# EAGLE design EXT_LED_RGB_NPN (EAGLE 6.5.0)
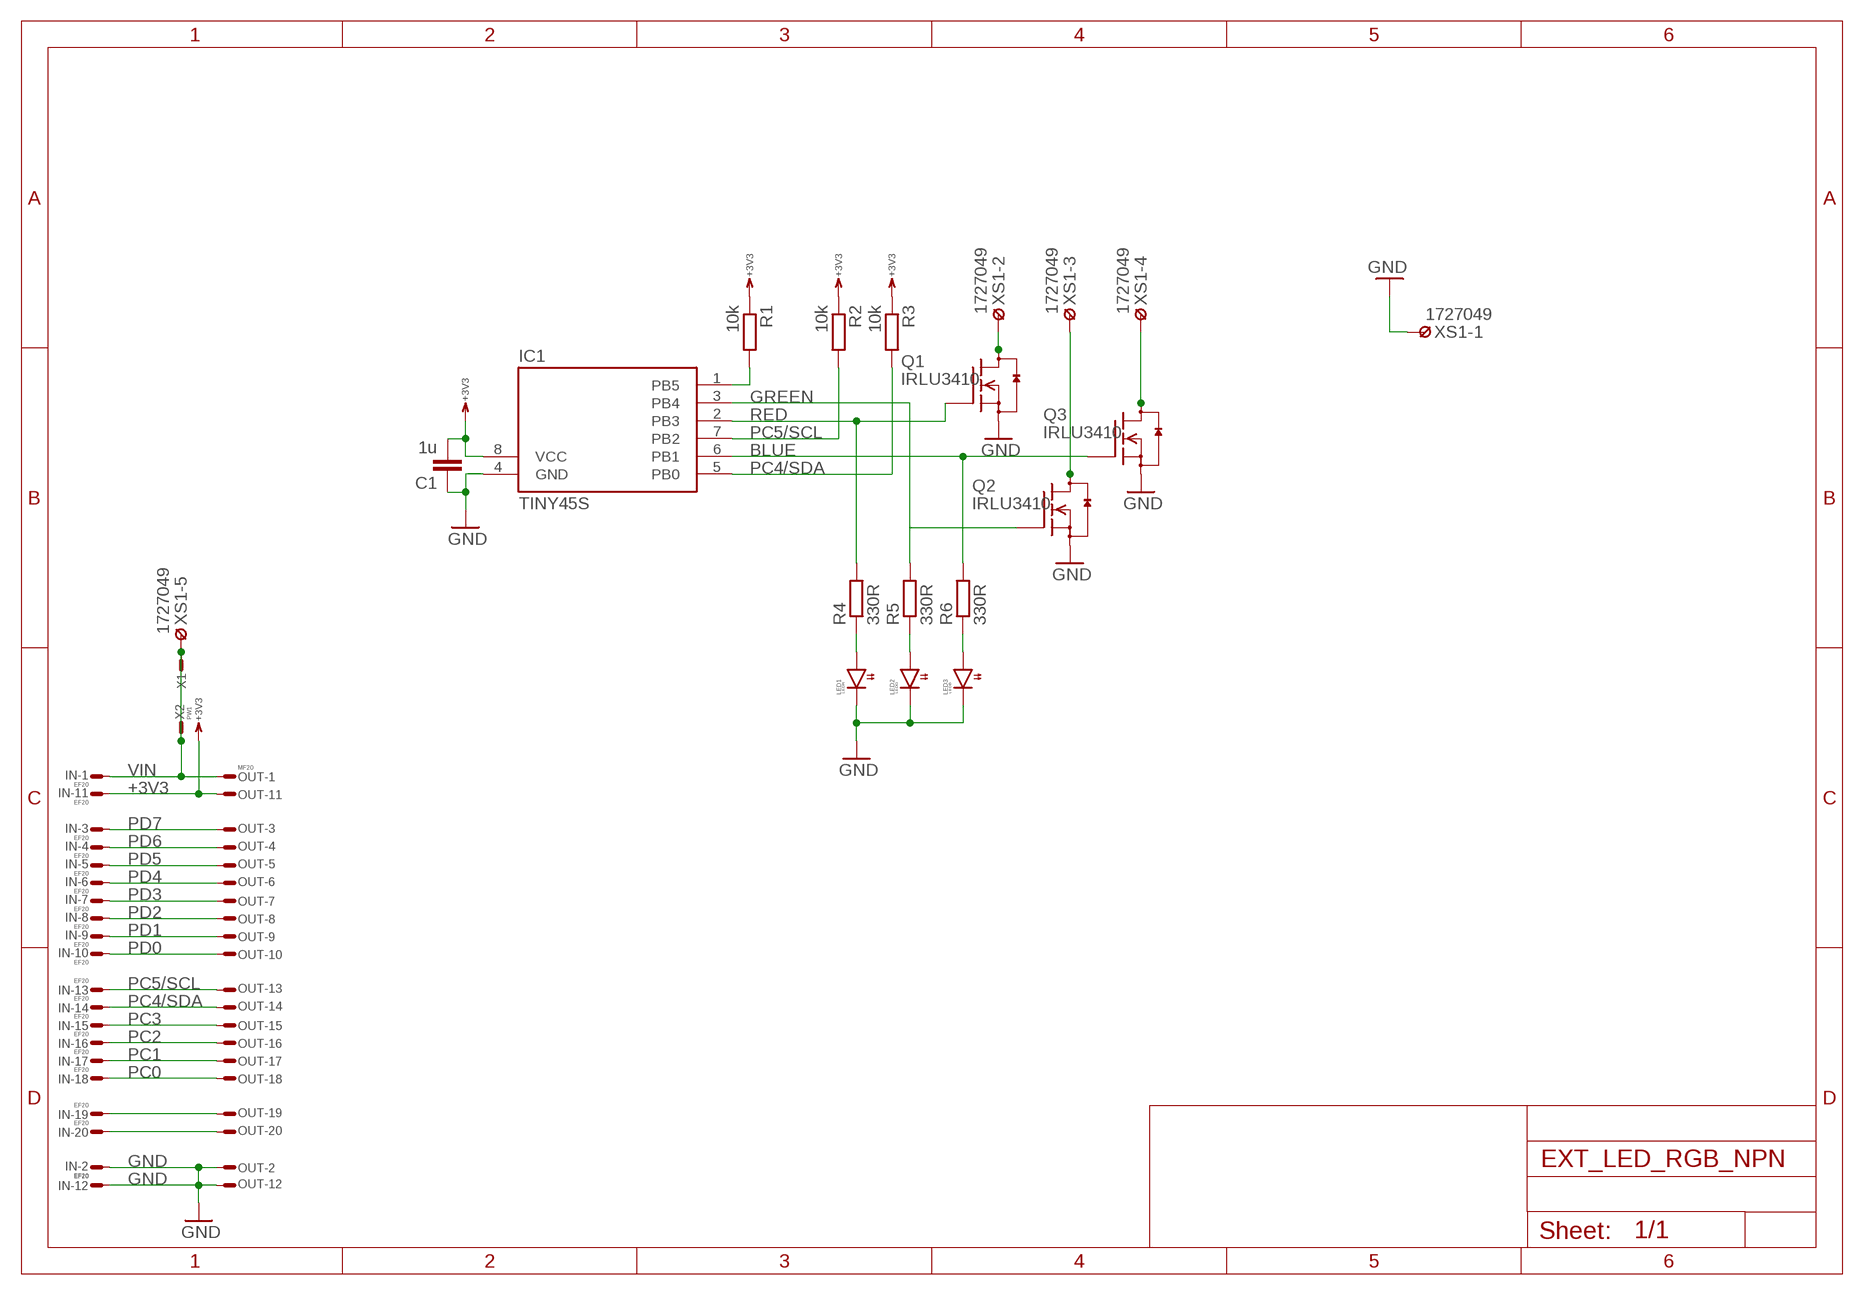
[diagram p0: schematic, sheet 1]

## Parts
C1  1u  C0603  [0603]
IC1  TINY45S  [SOIC8]
IN  EF20  FE20ELSS  [FE10-2WSS]
LED1  LEDR  LED1206  [1206]
LED2  LEDG  LED1206  [1206]
LED3  LEDB  LED1206  [1206]
OUT  MF20  ML20LSE  [ML20LS]
Q1  IRLU3410  FET-ND251  [TO251AA]
Q2  IRLU3410  FET-ND251  [TO251AA]
Q3  IRLU3410  FET-ND251  [TO251AA]
R1  10k  R0603  [0603]
R2  10k  R0603  [0603]
R3  10k  R0603  [0603]
R4  330R  R0603  [0603]
R5  330R  R0603  [0603]
R6  330R  R0603  [0603]
X1  WIREPADT1.6/0.9  [T1.6/0.9]
X2  PW1  WIREPADT1.6/0.9  [T1.6/0.9]
XS1  1727049  [1727049]

## Nets
+3V3: C1.2 IC1.8(VCC) IN.P$11 OUT.P$11 R1.1 R2.1 R3.1
BLUE: IC1.6(PB1) Q3.1(G) R6.2
GND: C1.1 IC1.4(GND) IN.P$2 IN.P$12 LED1.2(C) LED2.2(C) LED3.2(C) OUT.P$2 OUT.P$12 Q1.3(S) Q2.3(S) Q3.3(S) XS1.1
GREEN: IC1.3(PB4) Q2.1(G) R5.2
N$1: IN.P$20 OUT.P$20
N$3: IN.P$19 OUT.P$19
N$4: LED1.1(A) R4.1
N$5: LED2.1(A) R5.1
N$6: Q1.2(D) XS1.2
N$7: Q2.2(D) XS1.3
N$8: Q3.2(D) XS1.4
N$9: LED3.1(A) R6.1
PC0: IN.P$18 OUT.P$18
PC1: IN.P$17 OUT.P$17
PC2: IN.P$16 OUT.P$16
PC3: IN.P$15 OUT.P$15
PC4/SDA: IC1.5(PB0) IN.P$14 OUT.P$14 R3.2
PC5/SCL: IC1.7(PB2) IN.P$13 OUT.P$13 R2.2
PD0: IN.P$10 OUT.P$10
PD1: IN.P$9 OUT.P$9
PD2: IN.P$8 OUT.P$8
PD3: IN.P$7 OUT.P$7
PD4: IN.P$6 OUT.P$6
PD5: IN.P$5 OUT.P$5
PD6: IN.P$4 OUT.P$4
PD7: IN.P$3 OUT.P$3
RED: IC1.2(PB3) Q1.1(G) R4.2
RST: IC1.1(PB5) R1.2
VIN: IN.P$1 OUT.P$1 X1.1(S) X2.1(S) XS1.5

## Library data of the parts
C1 = RCL:C: Capacitor SMD
IC1 = atmel:TINY45: MICROCONTROLLER 2.7 V 1 Kbytes FLASH 64 bytes EEPROM 4-channel 10 bit ADC
IN = Conn:FE20E
LED1-LED3 = Optic:LED
OUT = Conn:ML20?E: HARTING
Q1-Q3 = Transistor:FET-ND
R1-R6 = RCL:R: Resistor SMD
X1 X2 = Conn:WIREPAD: Wire PAD connect wire on PCB
XS1 = Conn:1727049

## Board
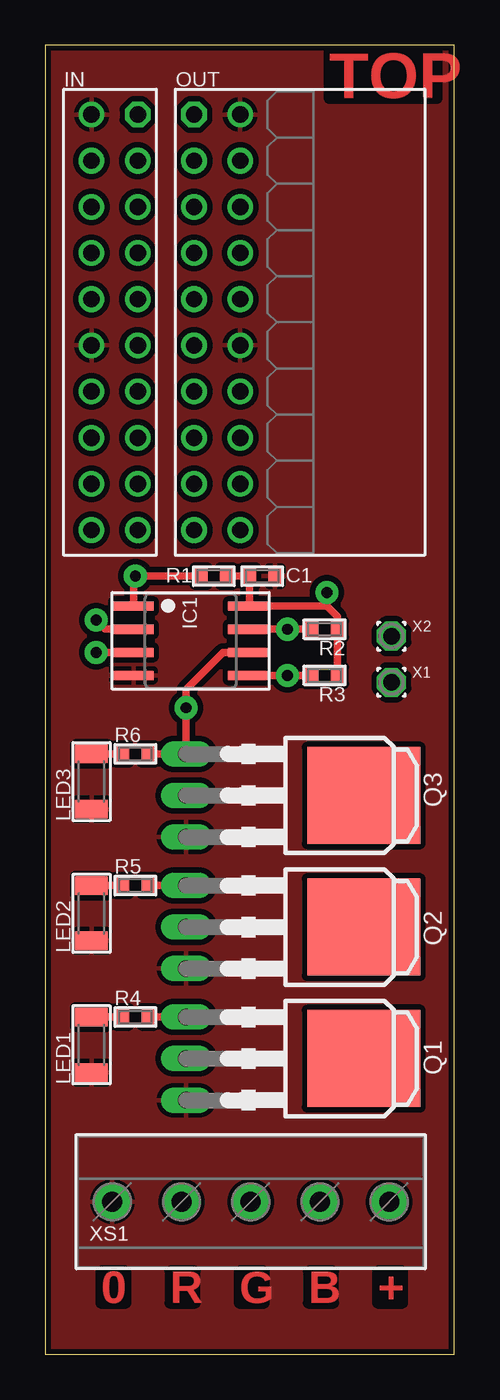
[diagram p1: board, top side]
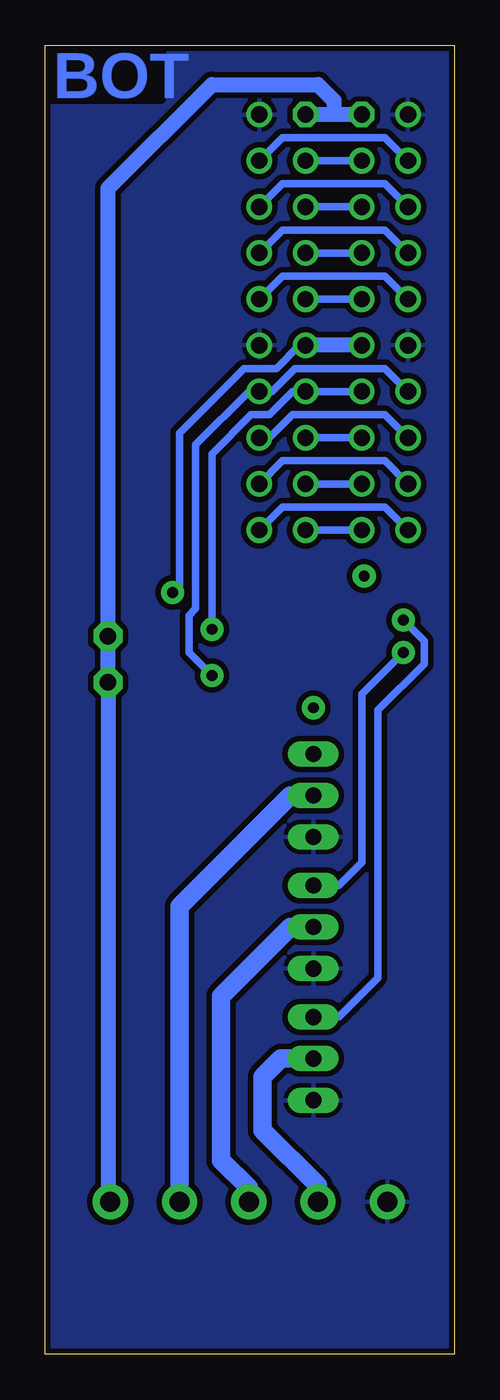
[diagram p2: board, bottom side, seen from below]

Size 22.5 x 72 mm. Coordinates in mm from the lower left corner, seen from the top.
Outline: 0,0 22.5,0 22.5,72 0,72 0,0
Copper layers (1*16): Top 0.035mm / dielectric 1.5mm / Bottom 0.035mm
Design rules "default *": minimum track width 10mil, minimum drill 10mil, track to track 12mil, track to pad 12mil, pad to pad 12mil, via to via 12mil, smd to smd 12mil, copper to edge 12mil, drill to drill 8mil, minimum pad ring 10mil, minimum via ring 8mil, stop-mask expansion 4mil, vias tented up to drill 50mil, thermal gap 10mil
tKeepout: area 0,0 to 22.5,2; area 0,70 to 22.5,72

### Footprints (pad centres in the part's own frame; a part is rotated, then mirrored left to right if it is on the bottom)
0603 = smd 0.7 x 0.9: 1 -0.697,0; 2 0.697,0
SOIC8 = smd 0.5 x 2.2: 1 -1.905,-3.154; 2 -0.635,-3.154; 3 0.635,-3.154; 4 1.905,-3.154; 5 1.905,3.154; 6 0.635,3.154; 7 -0.635,3.154; 8 -1.905,3.154
FE10-2WSS = drill 0.9 octagon: P$1 -11.43,1.27 | drill 0.9: P$2 -11.43,-1.27; P$3 -8.89,1.27; P$4 -8.89,-1.27; P$5 -6.35,1.27; P$6 -6.35,-1.27; P$7 -3.81,1.27; P$8 -3.81,-1.27; P$9 -1.27,1.27; P$10 -1.27,-1.27; P$11 1.27,1.27; P$12 1.27,-1.27; P$13 3.81,1.27; P$14 3.81,-1.27; P$15 6.35,1.27; P$16 6.35,-1.27; P$17 8.89,1.27; P$18 8.89,-1.27; P$19 11.43,1.27; P$20 11.43,-1.27
1206 = smd 1.016 x 1.778: 1 -1.524,0; 2 1.524,0
ML20LS = drill 0.9 octagon: P$1 -11.43,-1.27 | drill 0.9: P$2 -11.43,1.27; P$3 -8.89,-1.27; P$4 -8.89,1.27; P$5 -6.35,-1.27; P$6 -6.35,1.27; P$7 -3.81,-1.27; P$8 -3.81,1.27; P$9 -1.27,-1.27; P$10 -1.27,1.27; P$11 1.27,-1.27; P$12 1.27,1.27; P$13 3.81,-1.27; P$14 3.81,1.27; P$15 6.35,-1.27; P$16 6.35,1.27; P$17 8.89,-1.27; P$18 8.89,1.27; P$19 11.43,-1.27; P$20 11.43,1.27
TO251AA = drill 0.889 long: 1 -2.286,-5.334; 2 0,-5.334; 3 2.286,-5.334 | smd 5.334 x 6.223: 4 0,4.445
T1.6/0.9 = drill 0.914 pad 1.6 octagon: 1 0,0
1727049 = drill 1.1 pad 1.93: 1 -7.62,0; 2 -3.81,0; 3 0,0; 4 3.81,0; 5 7.62,0

### Placement (x,y rotation side)
C1  11.94,42.8 180 top
IC1  8,39.24 270 top
IN  3.81,56.77 270 top
LED1  2.54,17.02 270 top
LED2  2.54,24.26 270 top
LED3  2.54,31.5 270 top
OUT  9.45,56.77 270 top
Q1  13.08,16.26 270 top
Q2  13.08,23.5 270 top
Q3  13.08,30.73 270 top
R1  9.27,42.8 180 top
R2  15.37,39.88 180 top
R3  15.37,37.34 180 top
R4  4.95,18.54 0 top
R5  4.95,25.78 0 top
R6  4.95,33.02 0 top
X1  19.05,36.96 0 top
X2  19.05,39.5 0 top
XS1  11.3,8.38 0 top

### Tracks (layer width: path | path; a pad name or v marks a point on that pad's centre or on a via)
+3V3  (via drill 0.6 pad 1.27)
  Top 0.406: R3.1 R2.1 16.06,40.58 15.49,41.15 | 15.49,41.15 IC1.8 11.24,41.23 C1.2 R1.1 | v15.49,41.91 15.49,41.15
  Bottom 0.406: OUT.P$11 8.51,55.5 9.78,54.23 11.56,54.23 15.11,50.67 15.11,42.29 v15.49,41.91
  Bottom 0.813: IN.P$11 OUT.P$11
BLUE  (via drill 0.6 pad 1.27)
  Top 0.406: R6.2 Q3.1 v7.75,35.56 7.75,36.58 9.78,38.61 IC1.6
GND
  pour Bottom: 0,0.13 22.41,0.13 22.41,71.88 0,71.88
  pour Top: 0,0 22.41,0 22.41,71.88 0,71.88
GREEN  (via drill 0.6 pad 1.27)
  Top 0.406: R5.2 Q2.1 | IC1.3 v2.79,38.61
  Bottom 0.406: Q2.1 6.35,25.78 5.08,27.05 5.08,36.32 v2.79,38.61
N$1
  Bottom 0.406: IN.P$20 3.81,46.61 9.45,46.61 OUT.P$20
N$3
  Bottom 0.406: IN.P$19 OUT.P$19
N$4
  Top 0.406: R4.1 LED1.1
N$5
  Top 0.406: R5.1 LED2.1
N$6
  Bottom 1.016: XS1.2 7.49,9.27 10.54,12.32 10.54,15.24 9.53,16.26 Q1.2
N$7
  Bottom 1.016: Q2.2 9.02,23.5 12.83,19.68 12.83,10.67 11.3,9.14 XS1.3
N$8
  Bottom 1.016: XS1.4 15.11,24.64 9.02,30.73 Q3.2
N$9
  Top 0.406: R6.1 LED3.1
PC0
  Bottom 0.406: IN.P$18 3.81,49.15 9.45,49.15 OUT.P$18
PC1
  Bottom 0.406: IN.P$17 OUT.P$17
PC2
  Bottom 0.406: OUT.P$16 10.16,50.42 8.89,51.69 3.81,51.69 IN.P$16
PC3
  Bottom 0.406: IN.P$15 OUT.P$15
PC4/SDA  (via drill 0.6 pad 1.27)
  Top 0.406: IC1.5 v13.34,37.34 R3.2
  Bottom 0.406: IN.P$14 3.81,54.23 8.76,54.23 10.03,52.96 OUT.P$14 11.3,52.96 14.22,50.04 14.22,41.02 14.61,40.64 14.61,38.61 v13.34,37.34
PC5/SCL  (via drill 0.6 pad 1.27)
  Top 0.406: IC1.7 v13.34,39.88 R2.2
  Bottom 0.406: IN.P$13 OUT.P$13 8.89,52.96 10.16,51.69 11.18,51.69 13.34,49.53 v13.34,39.88
PD0
  Bottom 0.406: IN.P$10 3.81,59.31 9.45,59.31 OUT.P$10
PD1
  Bottom 0.406: IN.P$9 OUT.P$9
PD2
  Bottom 0.406: IN.P$8 3.81,61.85 9.45,61.85 OUT.P$8
PD3
  Bottom 0.406: IN.P$7 OUT.P$7
PD4
  Bottom 0.406: IN.P$6 3.81,64.39 9.45,64.39 OUT.P$6
PD5
  Bottom 0.406: IN.P$5 OUT.P$5
PD6
  Bottom 0.406: IN.P$4 3.81,66.93 9.45,66.93 OUT.P$4
PD7
  Bottom 0.406: IN.P$3 OUT.P$3
RED  (via drill 0.6 pad 1.27)
  Top 0.406: R4.2 Q1.1 | IC1.2 3.3,39.88 v2.79,40.39
  Bottom 0.406: Q1.1 6.35,18.54 4.19,20.7 4.19,35.43 1.65,37.97 1.65,39.24 v2.79,40.39
RST  (via drill 0.6 pad 1.27)
  Top 0.406: IC1.1 4.85,42.69 v4.95,42.8 R1.2
VIN
  Bottom 0.813: IN.P$1 6.6,68.2 | 6.6,68.2 OUT.P$1 | 6.6,68.2 6.6,68.96 7.49,69.85 13.34,69.85 19.05,64.14 X2.1 X1.1 19.05,8.51 XS1.5

### Text on the board
Top: TOP | 0 | R | G | B | +
Bottom: BOT
tStop: 0 | R | G | B | +